# Altium project ODF1.PrjPCB
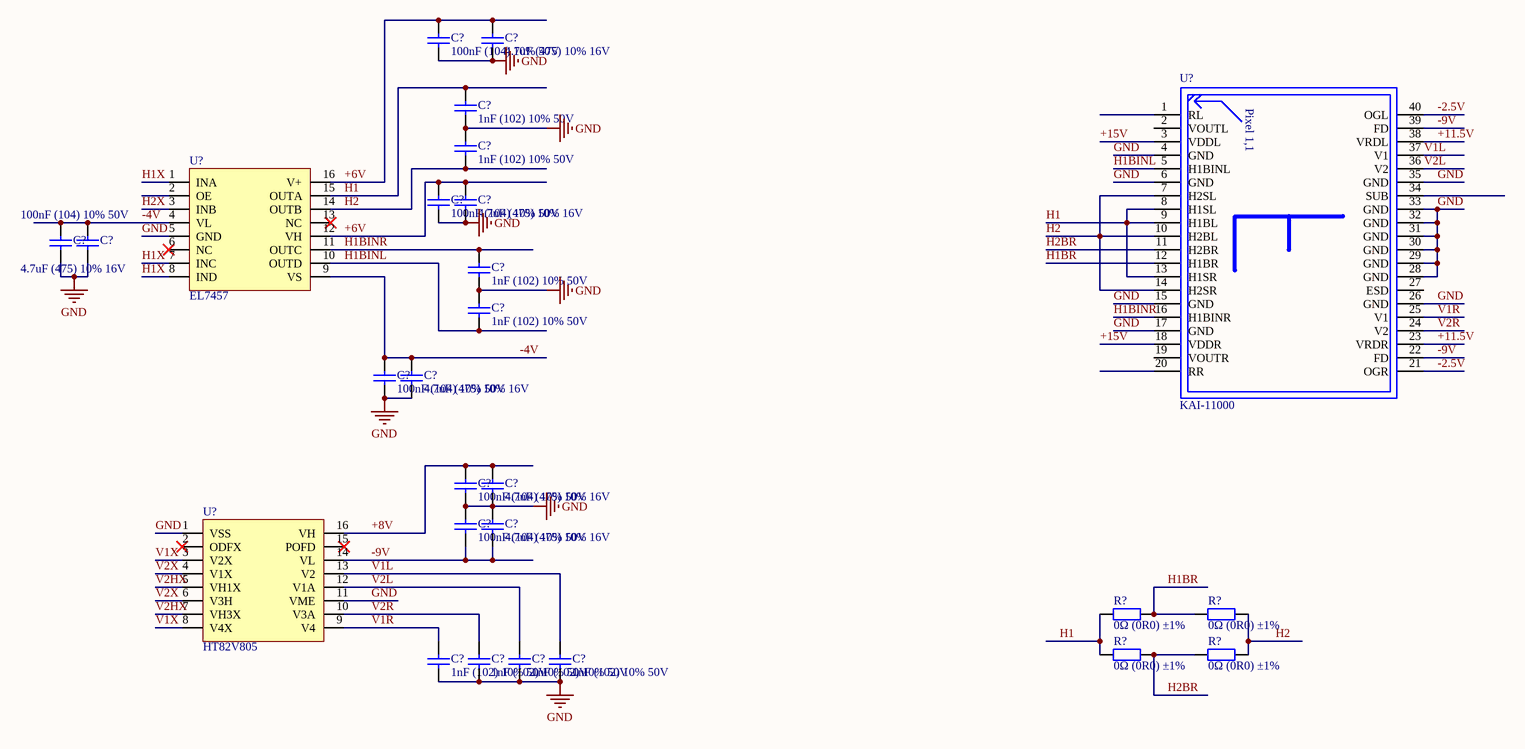
[diagram p0: ODF1.SchDoc]
3 sheets, 27 parts. Net scope: global (net labels, ports and power ports of the same name join across sheets).
Sheets:
  ODF1.SchDoc
  Power.SchDoc
  Driver.SchDoc

## Sheet ODF1.SchDoc
size A3

### Parts
(Parts that share a designator on the sheet are numbered #1, #2 ... from top to bottom, then left to right.)
C?#1  100nF (104) 10% 50V  [LC-0603_C]
C?#2  4.7uF (475) 10% 16V  [LC-0603_C]
C?#3  1nF (102) 10% 50V  [LC-0603_C]
C?#4  1nF (102) 10% 50V  [LC-0603_C]
C?#5  100nF (104) 10% 50V  [LC-0603_C]
C?#6  4.7uF (475) 10% 16V  [LC-0603_C]
C?#7  1nF (102) 10% 50V  [LC-0603_C]
C?#8  100nF (104) 10% 50V  [LC-0603_C]
C?#9  4.7uF (475) 10% 16V  [LC-0603_C]
C?#10  1nF (102) 10% 50V  [LC-0603_C]
C?#11  100nF (104) 10% 50V  [LC-0603_C]
C?#12  4.7uF (475) 10% 16V  [LC-0603_C]
C?#13  100nF (104) 10% 50V  [LC-0603_C]
C?#14  4.7uF (475) 10% 16V  [LC-0603_C]
C?#15  100nF (104) 10% 50V  [LC-0603_C]
C?#16  4.7uF (475) 10% 16V  [LC-0603_C]
C?#17  1nF (102) 10% 50V  [LC-0603_C]
C?#18  1nF (102) 10% 50V  [LC-0603_C]
C?#19  1nF (102) 10% 50V  [LC-0603_C]
C?#20  1nF (102) 10% 50V  [LC-0603_C]
R?#1  0Ω (0R0) ±1%  [LC-0603_R]
R?#2  0Ω (0R0) ±1%  [LC-0603_R]
R?#3  0Ω (0R0) ±1%  [LC-0603_R]
R?#4  0Ω (0R0) ±1%  [LC-0603_R]
U?#1  EL7457  [TSSOP16]
U?#2  KAI-11000
U?#3  HT82V805  [TSSOP16]

### Nets
GND: C?#1.1 C?#2.1 C?#3.1 C?#4.2 C?#5.1 C?#6.1 C?#7.1 C?#8.1 C?#9.1 C?#10.1 C?#11.1 C?#12.1 C?#13.1 C?#14.1 C?#15.2 C?#16.2 C?#17.1 C?#18.1 C?#19.1 C?#20.1 U?#1.5(GND) U?#2.4(GND) U?#2.6(GND) U?#2.15(GND) U?#2.17(GND) U?#2.26(GND) U?#2.28(GND) U?#2.29(GND) U?#2.30(GND) U?#2.31(GND) U?#2.32(GND) U?#2.33(GND) U?#2.35(GND) U?#3.1(VSS) U?#3.11(VME)
+6V: C?#1.2 C?#2.2 C?#5.2 C?#6.2 U?#1.12(VH) U?#1.16(V+)
+8V: C?#13.2 C?#14.2 U?#3.16(VH)
+11.5V: U?#2.23(VRDR) U?#2.38(VRDL)
+15V: U?#2.3(VDDL) U?#2.18(VDDR)
-2.5V: U?#2.21(OGR) U?#2.40(OGL)
-4V: C?#8.2 C?#9.2 C?#11.2 C?#12.2 U?#1.4(VL) U?#1.9(VS)
-9V: C?#15.1 C?#16.1 U?#2.22(FD) U?#2.39(FD) U?#3.14(VL)
H1: C?#3.2 R?#1.1 R?#3.1 U?#1.15(OUTA) U?#2.8(H1SL) U?#2.9(H1BL) U?#2.13(H1SR)
H1BINL: C?#7.2 U?#1.10(OUTD) U?#2.5(H1BINL)
H1BINR: C?#10.2 U?#1.11(OUTC) U?#2.16(H1BINR)
H1BR: R?#1.2 R?#2.1 U?#2.12(H1BR)
H1X: U?#1.1(INA) U?#1.7(INC) U?#1.8(IND)
H2: C?#4.1 R?#2.2 R?#4.2 U?#1.14(OUTB) U?#2.7(H2SL) U?#2.10(H2BL) U?#2.14(H2SR)
H2BR: R?#3.2 R?#4.1 U?#2.11(H2BR)
H2X: U?#1.3(INB)
V1L: C?#20.2 U?#2.37(V1) U?#3.13(V2)
V1R: C?#17.2 U?#2.25(V1) U?#3.9(V4)
V1X: U?#3.3(V2X) U?#3.8(V4X)
V2HX: U?#3.5(VH1X) U?#3.7(VH3X)
V2L: C?#19.2 U?#2.36(V2) U?#3.12(V1A)
V2R: C?#18.2 U?#2.24(V2) U?#3.10(V3A)
V2X: U?#3.4(V1X) U?#3.6(V3H)

Not connected (* = marked no-connect by the designer): U?#1 2(OE) 6(NC)* 13(NC)*; U?#2 1(RL) 2(VOUTL) 19(VOUTR) 20(RR) 27(ESD) 34(SUB); U?#3 2(ODFX)* 15(POFD)*

### Notes on the sheet
- (in symbol KAI-11000) Pixel 1,1

### Library data of the parts
C?#1 C?#5 C?#8 C?#11 C?#13 C?#15 = 0603 100nF (104) 10% 50V: 贴片电容; ComponentLink1Description: 供应商链接; ComponentLink1URL: http://www.szlcsc.com/product/details_15331.html; Package: 0603; Supplier: LC; SuppliersPartNumber: C14663
C?#2 C?#6 C?#9 C?#12 C?#14 C?#16 = 0603 4.7uF (475) 10% 16V: 贴片电容; ComponentLink1Description: 供应商链接; ComponentLink1URL: http://www.szlcsc.com/product/details_20375.html; Package: 0603; Supplier: LC; SuppliersPartNumber: C19666
C?#3 C?#4 C?#7 C?#10 C?#17-C?#20 = 0603 1nF (102) 10% 50V: 贴片电容; ComponentLink1Description: 供应商链接; ComponentLink1URL: http://www.szlcsc.com/product/details_1940.html; Package: 0603; Supplier: LC; SuppliersPartNumber: C1588
R?#1-R?#4 = 0603 0Ω (0R0) 1%: 贴片电阻; ComponentLink1Description: 供应商链接; ComponentLink1URL: http://www.szlcsc.com/product/details_21903.html; Package: 0603; Supplier: LC; SuppliersPartNumber: C21189
U?#1 = EL7457: CCD 驱动IC
U?#3 = HT82V805: CCD 驱动IC

## Sheet Power.SchDoc
size A3
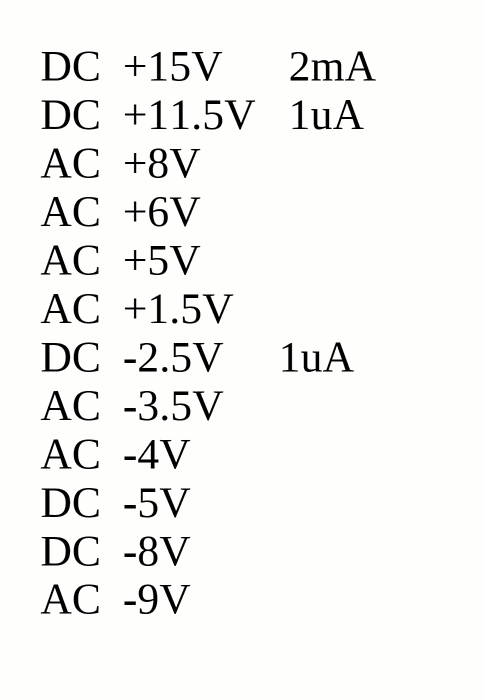
[diagram p1: Power.SchDoc]

### Notes on the sheet
- DC  +15V      2mA
  DC  +11.5V   1uA
  AC  +8V
  AC  +6V
  AC  +5V
  AC  +1.5V
  DC  -2.5V     1uA
  AC  -3.5V
  AC  -4V
  DC  -5V
  DC  -8V
  AC  -9V

## Sheet Driver.SchDoc
size A3